# EAGLE design pita (EAGLE 8.3.1)
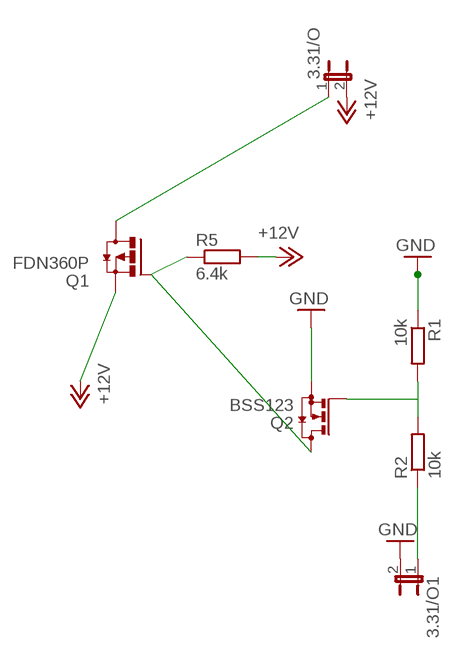
[diagram p0: schematic, sheet 1]

## Parts
3.31/O  JP1E  [JP1]
3.31/O1  JP1E  [JP1]
Q1  FDN360P  [SUPER-SOT3]
Q2  BSS123  [SOT23]
R1  10k  R-EU_0204/5  [0204/5]
R2  10k  R-EU_0204/5  [0204/5]
R5  6.4k  R-EU_0204/7  [0204/7]

## Nets
+12V: 3.31/O.2 Q1.2(S) R5.2
ARD_TR: 3.31/O1.1 R2.1
GND: 3.31/O1.2 Q2.2(S) R1.1
N$2: Q2.1(G) R1.2 R2.2
N$3: 3.31/O.1 Q1.3(D)
ON/OFF_GND: Q1.1(G) Q2.3(D) R5.1

## Library data of the parts
3.31/O 3.31/O1 = jumper:JP1E: JUMPER
Q1 = transistor-power:FDN360P: Single P-Channel, PowerTrench (R) MOSFET Source: http://www.fairchildsemi.com/ds/FD/FDN360P.pdf
Q2 = transistor-small-signal:BSS123: N-CHANNEL MOS FET
R1 R2 R5 = rcl:R-EU_: RESISTOR, European symbol

## Net classes
0 default: clearance 0.205 mm

## Board
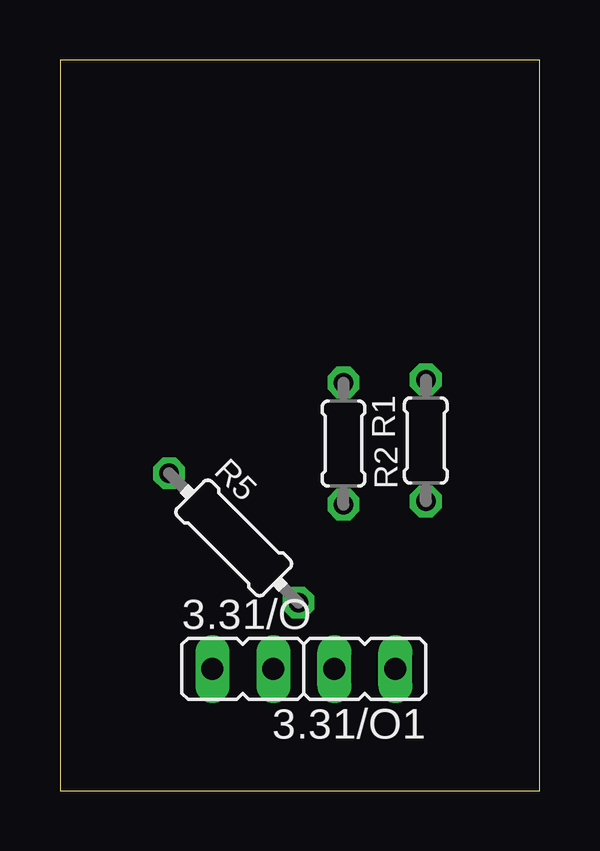
[diagram p1: board, top side]
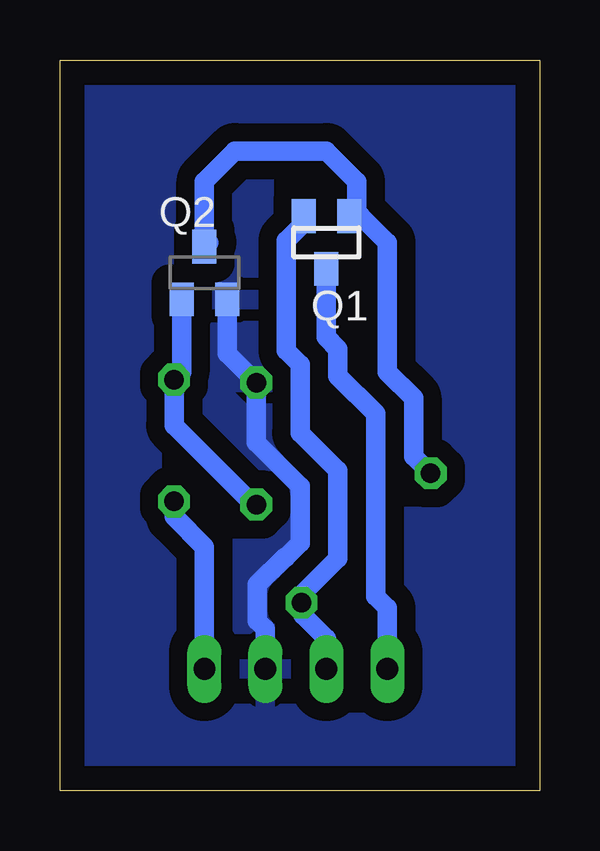
[diagram p2: board, bottom side, seen from below]

Size 19.99 x 30.47 mm. Coordinates in mm from the lower left corner, seen from the top.
Outline: 0,0 19.99,0 19.99,30.47 0,30.47 0,0
Copper layers (1*16): Top 0.035mm / dielectric 1.5mm / Bottom 0.035mm
Design rules "default *": minimum track width 6mil, minimum drill 0.35mm, track to track 30mil, track to pad 30mil, pad to pad 30mil, via to via 30mil, smd to smd 30mil, copper to edge 40mil, drill to drill 6mil, minimum pad ring 10mil, minimum via ring 8mil, stop-mask expansion 4mil, vias tented up to drill 0mil, thermal gap 10mil

### Footprints (pad centres in the part's own frame; a part is rotated, then mirrored left to right if it is on the bottom)
JP1 = drill 0.914 long: 1 0,-1.27; 2 0,1.27
SUPER-SOT3 = smd 1 x 1.4: 1 -0.95,-1.1; 2 0.95,-1.1; 3 0,1.1
SOT23 = smd 1 x 1.4: 1 -0.95,-1.1; 2 0.95,-1.1; 3 0,1.1
0204/5 = drill 0.813 octagon: 1 -2.54,0; 2 2.54,0
0204/7 = drill 0.813 octagon: 1 -3.81,0; 2 3.81,0

### Placement (x,y rotation side)
3.31/O  7.62,5.08 270 top
3.31/O1  12.7,5.08 90 top
Q1  8.89,22.86 180 bottom
Q2  13.97,21.59 0 bottom
R1  11.81,14.48 270 top
R2  15.24,14.61 90 top
R5  7.24,10.54 315 top

### Tracks (layer width: path | path; a pad name or v marks a point on that pad's centre or on a via)
+12V
  Bottom 0.813: Q1.2 9.84,23.66 10.56,22.94 10.56,18.35 9.98,17.78 9.98,14.92 8.41,13.35 8.41,9.69 9.93,8.16 R5.2 9.93,7.49 9.85,7.41 9.85,7.32 8.89,6.35 3.31/O.2
ARD_TR
  Bottom 0.813: R2.1 15.24,11.43 13.97,10.16 3.31/O1.1
GND
  Bottom 0.813: Q2.2 13.02,18.23 R1.1 11.81,14.52 9.98,12.7 9.98,10.34 10.59,9.73 10.63,9.73 11.76,8.6 11.76,7.09 11.43,6.76 3.31/O1.2
  pour Bottom: 20.32,30.48 0,30.48 0,0 20.32,0
N$2
  Bottom 0.813: R1.2 11.94,11.94 15.24,15.24 R2.2 14.92,17.46 Q2.1
N$3
  Bottom 0.813: Q1.3 8.89,18.91 8.41,18.43 8.41,17.3 6.83,15.72 6.83,8.1 6.35,7.62 3.31/O.1
ON/OFF_GND
  Bottom 0.813: 13.8,22.86 Q2.3 13.97,25.4 12.7,26.67 8.89,26.67 7.62,25.4 7.62,24.28 Q1.1 7.45,23.96 6.35,22.86 6.35,17.47 5.26,16.38 5.26,13.95 R5.1